# Altium schematic sheet Sheet1.SchDoc
size A; SheetNumber: 1; SheetTotal: 1
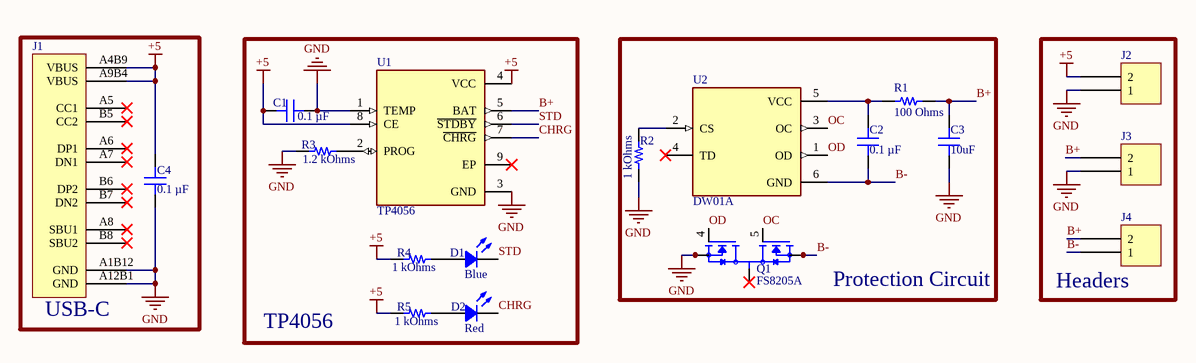
[diagram p0: Sheet1.SchDoc]

## Parts
C1  0.1 µF  [CAP 0805_2012]
C2  0.1 µF  [CAP 0805_2012]
C3  Capacitance: 10uF  [CAP 0805_2012]  (hidden comment: 0.1 µF)
C4  0.1 µF  [CAP 0805_2012]
D1  Blue  [LED 0805_2012 BLUE]
D2  Red  [LED 0805_2012 RED]
J1  UJ20-C-H-G-SMT-2-P16-TR  [Same Sky UJ20-C-H-G-SMT-2-P16-TR]  (value not drawn)
J2  B2B-PH-K-S(LF)(SN)  [JST B2B-PH-K]  (value not drawn)
J3  B2B-PH-K-S(LF)(SN)  [JST B2B-PH-K]  (value not drawn)
J4  B2B-PH-K-S(LF)(SN)  [JST B2B-PH-K]  (value not drawn)
Q1  FS8205A  [SOP65P640X120-8N]
R1  100 Ohms  [RES 0805_2012]
R2  1 kOhms  [RES 0805_2012]
R3  1.2 kOhms  [RES 0805_2012]
R4  1 kOhms  [RES 0805_2012]
R5  1 kOhms  [RES 0805_2012]
U1  TP4056  [SOP127P600X175-9N]
U2  DW01A  [SOT95P280X145-6N]

## Blocks framed on the sheet
USB-C: C4 J1
TP4056: C1 D1 D2 R3-R5 U1
Protection Circuit: C2 C3 Q1 R1 R2 U2
Headers: J2-J4

## Nets
+5: C1.2 C4.2 J1.A4B9(VBUS) J1.A9B4(VBUS) J2.2 R4.1 R5.1 U1.4(VCC) U1.8(CE)
GND: C1.1 C3.1 C4.1 J1.A1B12(GND) J1.A12B1(GND) J2.1 J3.1 Q1.2(S1) Q1.3(S1) R2.2 R3.2 U1.1(TEMP) U1.3(GND)
B+: C3.2 J3.2 J4.2 R1.1 U1.5(BAT)
B-: C2.1 J4.1 Q1.6(S2) Q1.7(S2) U2.6(GND)
CHRG: D2.2 U1.7(~{CHRG})
OC: Q1.5(G2) U2.3(OC)
OD: Q1.4(G1) U2.1(OD)
STD: D1.2 U1.6(~{STDBY})
NetC2_2: C2.2 R1.2 U2.5(VCC)
NetD1_1: D1.1 R4.2
NetD2_1: D2.1 R5.2
NetQ1_1: Q1.1(D12) Q1.8(D12)
NetR2_1: R2.1 U2.2(CS)
NetR3_1: R3.1 U1.2(PROG)

Not connected (* = marked no-connect by the designer): J1 A5(CC1)* A6(DP1)* A7(DN1)* A8(SBU1)* B5(CC2)* B6(DP2)* B7(DN2)* B8(SBU2)*; U1 9(EP)*; U2 4(TD)*

## Library data of the parts
C1-C4 = CC0805MRX7R9BB104: CAP CER 0.1UF 50V X7R 0805; manufacturer: Yageo; Tolerance: ±20%; Part Number: CC0805MRX7R9BB104; Applications: General Purpose; componentlink1description: Datasheet; componentlink1url: https://www.yageo.com/upload/media/product/productsearch/datasheet/mlcc/UPY-GPHC_X7R_6.3V-to-50V_18.pdf; componentlink2description: DigiKey Link; componentlink2url: https://www.digikey.com/en/products/detail/yageo/CC0805MRX7R9BB104/5884281; Device Package: 0805 (2012 Metric); lastupdated: 4/6/2026 7:33:19 PM; Lifecycle Status: Active; Minimum Order: 1; Mounting Type: Surface Mount, MLCC; Operating Temperature: -55°C ~ 125°C; Package / Case: 0805 (2012 Metric); packaging: TapeAndReel; partid: 2475; Part Status: Active; price: 0.01; series: CC; Size / Dimension: 0.079" L x 0.049" W (2.00mm x 1.25mm); Supplier 1: DigiKey; Supplier Part Number 1: 311-4351-1-ND; Temperature Coefficient: X7R; Thickness (Max): 0.037" (0.95mm); value: 0.1 µF; Voltage - Rated: 50V
  C1 C2 C4: Capacitance: 0.1 µF
D1 = SML-LX0805USBC-TR: LED BLUE CLEAR SMD; Manufacturer: Lumex Opto/Components Inc.; Configuration: Standard; Current - Test: 20mA; Lens Color: Colorless; Lens Size: 1.40mm x 1.25mm; Lens Style: Rectangle with Flat Top; Millicandela Rating: 25mcd; Viewing Angle: 140°; Voltage - Forward (Vf) (Typ): 3.5V; Wavelength - Peak: 470nm; Part Number: SML-LX0805USBC-TR; Color: Blue; ComponentLink1Description: Datasheet; ComponentLink1URL: //media.digikey.com/pdf/Data%20Sheets/Lumex%20PDFs/SML-LX0805USBC-TR.pdf; ComponentLink2Description: DigiKey Link; ComponentLink2URL: https://www.digikey.com/en/products/detail/lumex-opto-components-inc/SML-LX0805USBC-TR/408124; Device Package: 0805 (2012 Metric); LastUpdated: 4/5/2026 8:35:18 PM; Lens Transparency: Clear; Lifecycle Status: Active; Minimum Order: 1; Mounting Type: Surface Mount; Package / Case: 0805 (2012 Metric); Packaging: TapeAndReel; PartId: 764; Part Status: Active; Price: 0.59; Series: -; Size / Dimension: 2.00mm L x 1.25mm W; Supplier 1: DigiKey; Supplier Part Number 1: 67-1638-1-ND; Value: Blue
D2 = LTST-C170KAKT: LED RED CLEAR SMD; Manufacturer: Lite-On Inc.; Configuration: Standard; Current - Test: 20mA; Lens Color: Colorless; Lens Size: 1.40mm x 1.25mm; Lens Style: Rectangle with Flat Top; Millicandela Rating: 54mcd; Viewing Angle: 130°; Voltage - Forward (Vf) (Typ): 2V; Wavelength - Dominant: 615nm; Wavelength - Peak: 621nm; Part Number: LTST-C170KAKT; Color: Red; ComponentLink1Description: Datasheet; ComponentLink1URL: http://optoelectronics.liteon.com/upload/download/DS-22-99-0182/LTST-C170KAKT.pdf; ComponentLink2Description: DigiKey Link; ComponentLink2URL: http://digikey.com/product-detail/en/lite-on-inc/LTST-C170KAKT/160-1412-1-ND/386772; Device Package: 0805 (2012 Metric); Height (Max): 1.10mm; LastUpdated: 4/5/2026 8:38:27 PM; Lens Transparency: Clear; Lifecycle Status: Active; Minimum Order: 1; Mounting Type: Surface Mount; Package / Case: 0805 (2012 Metric); Packaging: TapeAndReel; PartId: 305; Part Status: Active; Price: 0.07; Series: -; Size / Dimension: 2.00mm L x 1.25mm W; Supplier 1: DigiKey; Supplier Part Number 1: 160-1412-1-ND; Value: Red
J1 = UJ20-C-H-G-SMT-2-P16-TR: CONN RCPT USB 2.0 TYPE C SMD RA; Manufacturer: Same Sky (Formerly CUI Devices); Connector Type: USB-C (USB TYPE-C); Current Rating (Amps): 0.25A, 1.25A, 5A; Gender: Receptacle; Mating Cycles: 10000; Number of Contacts: 24 (16+8 Dummy); Number of Ports: 1; Shielding: Shielded; Specifications: USB 2.0; Part Number: UJ20-C-H-G-SMT-2-P16-TR; ComponentLink1Description: Datasheet; ComponentLink1URL: https://www.sameskydevices.com/product/resource/uj20-c-h-g-smt-2-p16-tr.pdf; ComponentLink2Description: DigiKey Link; ComponentLink2URL: https://www.digikey.com/en/products/detail/same-sky-formerly-cui-devices/UJ20-C-H-G-SMT-2-P16-TR/24818577; Features: 3.0µ" Finish Thickness; LastUpdated: 2/6/2026 9:26:35 AM; Lifecycle Status: Active; Minimum Order: 1; Mounting Feature: Horizontal; Mounting Type: Surface Mount, Right Angle; Through Hole; Operating Temperature: -25°C ~ 85°C; Packaging: TapeAndReel; Price: 0.49; Series: UJ20; Supplier 1: DigiKey; Supplier Part Number 1: 2223-UJ20-C-H-G-SMT-2-P16-TRCT-ND; Termination: Solder
J2-J4 = B2B-PH-K-S(LF)(SN): CONN HEADER VERT 2POS 2MM; Manufacturer: JST Sales America Inc.; Contact Length - Mating: 0.130" (3.30mm); Contact Length - Post: 0.134" (3.40mm); Current Rating (Amps): 2A; Material Flammability Rating: UL94 V-0; Number of Positions: 2; Number of Positions Loaded: All; Overall Contact Length: 0.333" (8.45mm); Pitch - Mating: 0.079" (2.00mm); Shrouding: Shrouded - 4 Wall; Style: Board to Cable/Wire; Voltage Rating: 100V; Part Number: B2B-PH-K-S(LF)(SN); ComponentLink1Description: Datasheet; ComponentLink1URL: http://www.jst-mfg.com/product/pdf/eng/ePH.pdf; ComponentLink2Description: DigiKey Link; ComponentLink2URL: http://digikey.com/product-detail/en/jst-sales-america-inc/B2B-PH-K-S-LF-SN/455-1704-ND/926611; Connector Type: Header; Contact Finish - Mating: Tin; Contact Finish - Post: Tin; Contact Material: Brass; Contact Shape: Square; Contact Type: Male Pin; Fastening Type: Detent Lock; Insulation Color: Natural; Insulation Height: 0.236" (6.00mm); Insulation Material: Polyamide (PA66), Nylon 6/6; LastUpdated: 1/3/2020 11:40:58 PM; Lifecycle Status: Active; Minimum Order: 1; Mounting Type: Through Hole; Number of Rows: 1; Operating Temperature: -25°C ~ 85°C; Packaging: Bulk; PartId: 11; Part Status: Active; Price: 0.17; Series: PH; Supplier 1: DigiKey; Supplier Part Number 1: 455-1704-ND; Termination: Press-Fit, Solder
Q1 = FS8205A: MF: Fortune Semiconductor; SnapEDA_Link: https://www.snapeda.com/parts/FS8205A/Fortune+Semiconductor/view-part/?ref=snap; Package: Package; Value: *; MP: FS8205A; Check_prices: https://www.snapeda.com/parts/FS8205A/Fortune+Semiconductor/view-part/?ref=eda
R1 R3 = RNCS0805BKE1K00: RES 1K OHM 0.1% 1/10W 0805; Manufacturer: Stackpole Electronics Inc; Power (Watts): 0.1W, 1/10W; Resistance: 1 kOhms; Temperature Coefficient: ±25ppm/°C; Part Number: RNCS0805BKE1K00; ComponentLink1Description: Datasheet; ComponentLink1URL: https://www.seielect.com/catalog/sei-rncs_rnch.pdf; ComponentLink2Description: DigiKey Link; ComponentLink2URL: https://www.digikey.com/en/products/detail/stackpole-electronics-inc/RNCS0805BKE1K00/1800073; Composition: Thin Film; Device Package: 0805 (2012 Metric); Features: Anti-Corrosive, Automotive AEC-Q200, Moisture Resistant; Height - Seated (Max): 0.026" (0.65mm); LastUpdated: 4/5/2026 8:11:26 PM; Lifecycle Status: Active; Minimum Order: 1; Number of Terminations: 2; Operating Temperature: -55°C ~ 155°C; Package / Case: 0805 (2012 Metric); Packaging: TapeAndReel; PartId: 27715; Part Status: Active; Price: 0.08; Ratings: AEC-Q200; Series: RNCS; Size / Dimension: 0.079" L x 0.049" W (2.00mm x 1.25mm); Supplier 1: DigiKey; Supplier Part Number 1: RNCS0805BKE1K00CT-ND; Supplier Device Package: 0805; Tolerance: ±0.1%
  R1: Value: 100 Ohms
  R3: Value: 1.2 kOhms
R2 R4 R5 = RNCS0805BKE1K00: RES 1K OHM 0.1% 1/10W 0805; Manufacturer: Stackpole Electronics Inc; Power (Watts): 0.1W, 1/10W; Temperature Coefficient: ±25ppm/°C; Part Number: RNCS0805BKE1K00; Value: 1 kOhms; ComponentLink1Description: Datasheet; ComponentLink1URL: https://www.seielect.com/catalog/sei-rncs_rnch.pdf; ComponentLink2Description: DigiKey Link; ComponentLink2URL: https://www.digikey.com/en/products/detail/stackpole-electronics-inc/RNCS0805BKE1K00/1800073; Composition: Thin Film; Device Package: 0805 (2012 Metric); Features: Anti-Corrosive, Automotive AEC-Q200, Moisture Resistant; Height - Seated (Max): 0.026" (0.65mm); LastUpdated: 4/5/2026 8:11:26 PM; Lifecycle Status: Active; Minimum Order: 1; Number of Terminations: 2; Operating Temperature: -55°C ~ 155°C; Package / Case: 0805 (2012 Metric); Packaging: TapeAndReel; PartId: 27715; Part Status: Active; Price: 0.08; Ratings: AEC-Q200; Resistance: 1 kOhms; Series: RNCS; Size / Dimension: 0.079" L x 0.049" W (2.00mm x 1.25mm); Supplier 1: DigiKey; Supplier Part Number 1: RNCS0805BKE1K00CT-ND; Supplier Device Package: 0805; Tolerance: ±0.1%
U1 = TP4056: Complete single cell Li-Ion battery with a constant current / constant voltage linear charger; MF: NanJing Top Power ASIC Corp.; Check_prices: https://www.snapeda.com/parts/TP4056/NanJing+Top+Power+ASIC+Corp./view-part/?ref=eda; SnapEDA_Link: https://www.snapeda.com/parts/TP4056/NanJing+Top+Power+ASIC+Corp./view-part/?ref=snap; Price: None; Availability: Not in stock; Package: Package; MP: TP4056; Value: *
U2 = DW01A: One Cell Lithium-ion/Polymer Battery Protection IC; MF: Fortune Semiconductor; SnapEDA_Link: https://www.snapeda.com/parts/DW01A/Fortune+Semiconductor/view-part/?ref=snap; Package: SOT-23-6 Fortune Semiconductor; Value: *; MP: DW01A; Check_prices: https://www.snapeda.com/parts/DW01A/Fortune+Semiconductor/view-part/?ref=eda